# EAGLE design ESP-programmer-2 (EAGLE 9.4.2)
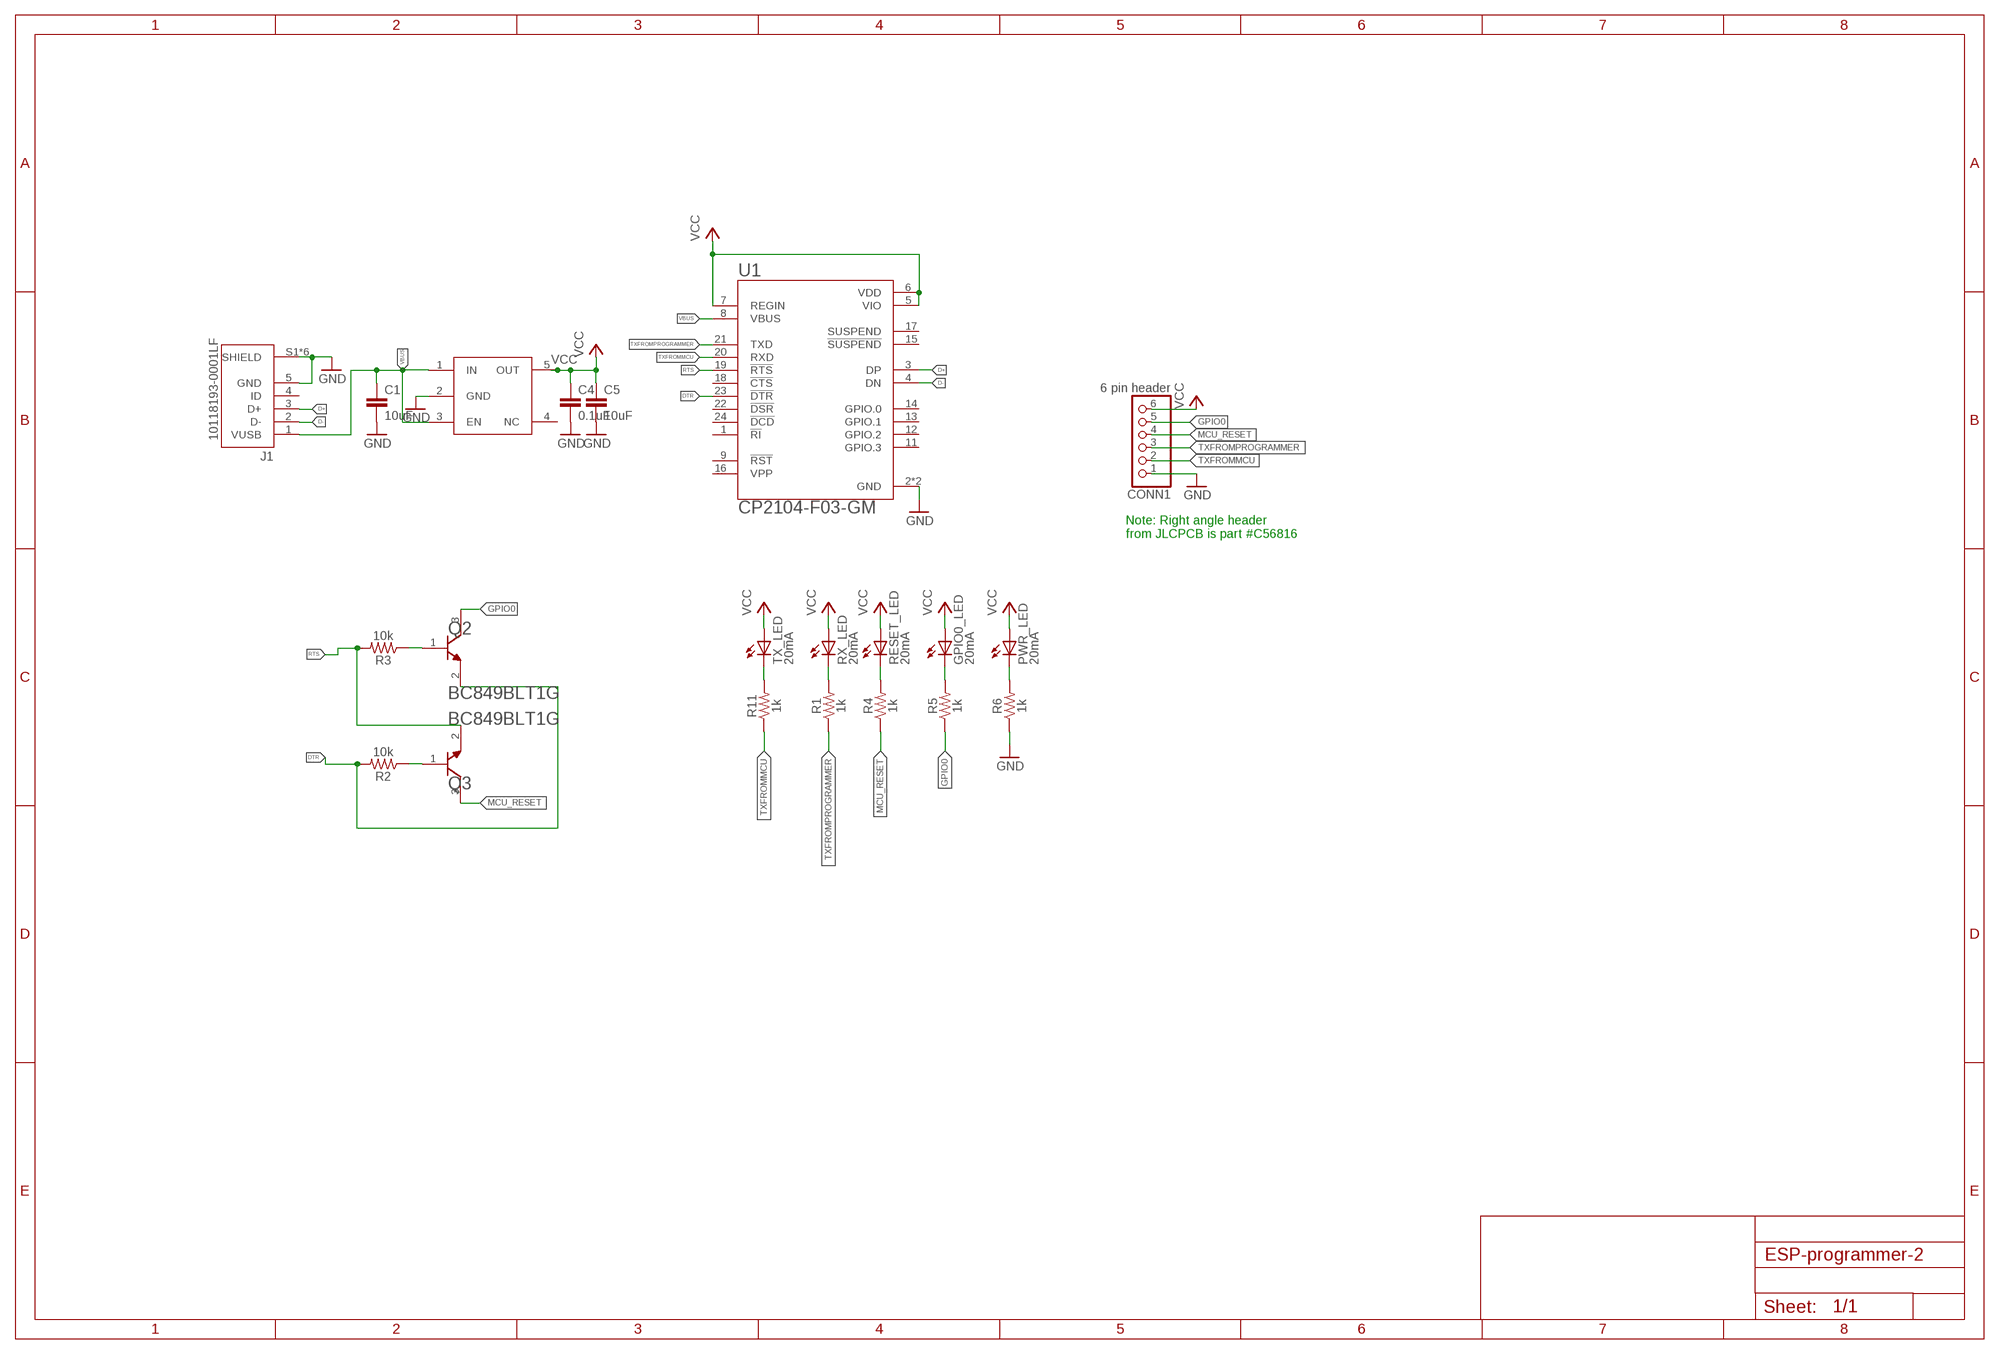
[diagram p0: schematic, sheet 1]

## Parts
C1  10uF  C-EUC0603  [C0603]
C4  0.1uF  C-EUC0603  [C0603]
C5  10uF  C-EUC0603  [C0603]
CONN1  6 pin header  PINHD-1X6  [1X06]
GPIO0_LED  20mA  LEDCHIP-LED0603  [CHIP-LED0603]
J1  10118193-0001LF  [FCI_10118193-0001LF]
PWR_LED  20mA  LEDCHIP-LED0603  [CHIP-LED0603]
Q2  ON_SEMICONDUCTOR_BC849BLT1GON_SEMICONDUCTOR_BC849BLT1G_0_0  [ON_SEMICONDUCTOR_BC849BLT1G_0]
Q3  ON_SEMICONDUCTOR_BC849BLT1GON_SEMICONDUCTOR_BC849BLT1G_0_0  [ON_SEMICONDUCTOR_BC849BLT1G_0]
R1  1k  10KOHM-0603-1/10W-1%  [0603]
R2  10k  10KOHM-0603-1/10W-1%  [0603]
R3  10k  10KOHM-0603-1/10W-1%  [0603]
R4  1k  10KOHM-0603-1/10W-1%  [0603]
R5  1k  10KOHM-0603-1/10W-1%  [0603]
R6  1k  10KOHM-0603-1/10W-1%  [0603]
R11  1k  10KOHM-0603-1/10W-1%  [0603]
REG  3v3 LDO  NCP718BSN330T1G  [NCP718BSN330T1G]
RESET_LED  20mA  LEDCHIP-LED0603  [CHIP-LED0603]
RX_LED  20mA  LEDCHIP-LED0603  [CHIP-LED0603]
TX_LED  20mA  LEDCHIP-LED0603  [CHIP-LED0603]
U1  CP2104-F03-GM  [QFN50P400X400X80-25N]

## Nets
D+: J1.3(D+) U1.3(DP)
D-: J1.2(D-) U1.4(DN)
DTR: Q2.2(E) R2.2 U1.23(!DTR)
GND: C1.2 C4.2 C5.2 CONN1.1 J1.5(GND) J1.S1(SHIELD) J1.S2(SHIELD) J1.S3(SHIELD) J1.S4(SHIELD) J1.S5(SHIELD) J1.S6(SHIELD) R6.1 REG.2(GND) U1.2(GND) U1.25(GND)
GPIO0: CONN1.5 Q2.3(C) R5.1
MCU_RESET: CONN1.4 Q3.3(C) R4.1
N$3: Q3.1(B) R2.1
N$4: Q2.1(B) R3.1
RTS: Q3.2(E) R3.2 U1.19(!RTS)
STATUSTOLED: R11.2 TX_LED.C
STATUSTOLED1: R1.2 RX_LED.C
STATUSTOLED2: R4.2 RESET_LED.C
STATUSTOLED3: GPIO0_LED.C R5.2
STATUSTOLED4: PWR_LED.C R6.2
TXFROMMCU: CONN1.2 R11.1 U1.20(RXD)
TXFROMPROGRAMMER: CONN1.3 R1.1 U1.21(TXD)
VBUS: C1.1 J1.1(VUSB) REG.1(IN) REG.3(EN) U1.8(VBUS)
VCC: C4.1 C5.1 CONN1.6 GPIO0_LED.A PWR_LED.A REG.5(OUT) RESET_LED.A RX_LED.A TX_LED.A U1.5(VIO) U1.6(VDD) U1.7(REGIN)
Unconnected: J1.4(ID) REG.4(NC) U1.1(!RI) U1.9(!RST!) U1.11(GPIO.3) U1.12(GPIO.2) U1.13(GPIO.1) U1.14(GPIO.0) U1.15(!SUSPEND!) U1.16(VPP) U1.17(SUSPEND) U1.18(!CTS) U1.22(!DSR) U1.24(!DCD)

## Notes on the sheet
- Note: Right angle header
  from JLCPCB is part #C56816

## Library data of the parts
C1 C4 C5 = rcl:C-EU: CAPACITOR, European symbol; SPICEPREFIX: C
CONN1 = adafruit:PINHD-1X6: PIN HEADER
GPIO0_LED PWR_LED RESET_LED RX_LED TX_LED = led:LED: LED OSRAM: - CHIPLED LG R971, LG N971, LY N971, LG Q971, LY Q971, LO R971, LY R971 LH N974, LH R974 LS Q976, LO Q976, LY Q976 LO Q996 - Hyper CHIPLED LW Q18S LB Q993, LB Q99A, LB R99A - SideLED LS A670, LO A670, LY A670, LG A670, LP A670 LB A673, LV A673, LT A673, LW A673 LH A674 LY A675 LS A676, LA A676, LO A676, LY A676, LW A676 LS A679, LY A679, LG A679 - Hyper Micro SIDELED® LS Y876, LA Y876, LO Y876, LY Y876 LT Y87S - SmartLED LW L88C, LW L88S LB L89C, LB L89S, LG L890 LS L89K, LO L89K, LY L89K LS L896, LA L896, LO L896, LY L896 - TOPLED LS T670, LO T670, LY T670, LG T670, LP T670 LSG T670, LSP T670, LSY T670, LOP T670, LYG T670 LG T671, LOG T671, LSG T671 LB T673, LV T673, LT T673, LW T673 LH T674 LS T676, LA T676, LO T676, LY T676, LB T676, LH T676, LSB T676, LW T676 LB T67C, LV T67C, LT T67C, LS T67K, LO T67K, LY T67K, LW E67C LS E67B, LA E67B, LO E67B, LY E67B, LB E67C, LV E67C, LT E67C LW T67C LS T679, LY T679, LG T679 LS T770, LO T770, LY T770, LG T770, LP T770 LB T773, LV T773, LT T773, LW T773 LH T774 LS E675, LA E675, LY E675, LS T675 LS T776, LA T776, LO T776, LY T776, LB T776 LHGB T686 LT T68C, LB T68C - Hyper Mini TOPLED® LB M676 - Mini TOPLED Santana® LG M470 LS M47K, LO M47K, LY M47K Source: http://www.osram.convergy.de LUXEON: - LUMILED® LXK2-PW12-R00, LXK2-PW12-S00, LXK2-PW14-U00, LXK2-PW14-V00 LXK2-PM12-R00, LXK2-PM12-S00, LXK2-PM14-U00 LXK2-PE12-Q00, LXK2-PE12-R00, LXK2-PE12-S00, LXK2-PE14-T00, LXK2-PE14-U00 LXK2-PB12-K00, LXK2-PB12-L00, LXK2-PB12-M00, LXK2-PB14-N00, LXK2-PB14-P00, LXK2-PB14-Q00 LXK2-PR12-L00, LXK2-PR12-M00, LXK2-PR14-Q00, LXK2-PR14-R00 LXK2-PD12-Q00, LXK2-PD12-R00, LXK2-PD12-S00 LXK2-PH12-R00, LXK2-PH12-S00 LXK2-PL12-P00, LXK2-PL12-Q00, LXK2-PL12-R00 Source: www.luxeon.com KINGBRIGHT: KA-3528ASYC Source: www.kingbright.com
J1 = 10118193-0001LF:10118193-0001LF: Micro USB B Type Receptacle; AVAILABILITY: Unavailable; DESCRIPTION: Single Port 5 Contact Shielded SMT MICRO USB B-Type Receptacle; MF: Amphenol FCI; MP: 10118193-0001LF; PACKAGE: None; PRICE: None
Q2 Q3 = On Semiconductor - BC849BLT1G:ON_SEMICONDUCTOR_BC849BLT1G: ONSC-NPN-B1E2C3-3; CIIVA_IDS: 19369299; COMPONENT_LINK_1_DESCRIPTION: Manufacturer URL; COMPONENT_LINK_1_URL: http://www.onsemi.com/; COMPONENT_LINK_3_DESCRIPTION: Package Specification; COMPONENT_LINK_3_URL: http://www.onsemi.cn/pub_link/Collateral/318-08.PDF; DATASHEET: http://www.onsemi.cn/pub_link/Collateral/BC846ALT1-D.PDF; DATASHEET_VERSION: Rev. 11; FOOTPRINT_VARIANT_NAME_0: Manufacturer Recommended; FT_MIN_MHZ: 100; IC_CONTINUOUS_A: 0.1; IMPORTED: yes; IMPORTED_FROM: vault; IMPORT_TS: 1521843736; MF: On Semiconductor; MOUNTING_TECHNOLOGY: Surface Mount; MPN: BC849BLT1G; PACKAGE: SOT-23-3-318-08; PACKAGE_DESCRIPTION: 3-Pin Small Outline Transistor, Body 2.92 x 1.3 mm, Pitch 0.95 mm; PACKAGE_VERSION: Rev. AP, 11/2009; PACKING: Tape and Reel; POLARITY: NPN; PREFIX: Q; RELEASE_DATE: 1406898388; ROHS: Yes; VAULT_GUID: 19D3C7D6-08FD-4A81-9BD4-62C7617130FB; VAULT_REVISION: B4675A61-FAF7-4072-9C56-0A9635A35669
R1 R4-R6 R11 = SparkFun-Resistors:10KOHM: 10kΩ resistor A resistor is a passive two-terminal electrical component that implements electrical resistance as a circuit element. Resistors act to reduce current flow, and, at the same time, act to lower voltage levels within circuits. - Wikipedia; PROD_ID: RES-00824; VALUE: 10k
R2 R3 = SparkFun-Resistors:10KOHM: 10kΩ resistor A resistor is a passive two-terminal electrical component that implements electrical resistance as a circuit element. Resistors act to reduce current flow, and, at the same time, act to lower voltage levels within circuits. - Wikipedia; PROD_ID: RES-00824
REG = IC-packages_BIG-pack V1.0:NCP718BSN330T1G
U1 = CP2104:CP2104: Silabs CP2104 USB to UART Bridge; AVAILABILITY: Unavailable; DESCRIPTION: USB to UART Bridge; MF: Silicon Labs; MP: CP2104; PACKAGE: QFN-24 Silicon Labs; PRICE: None

## Board
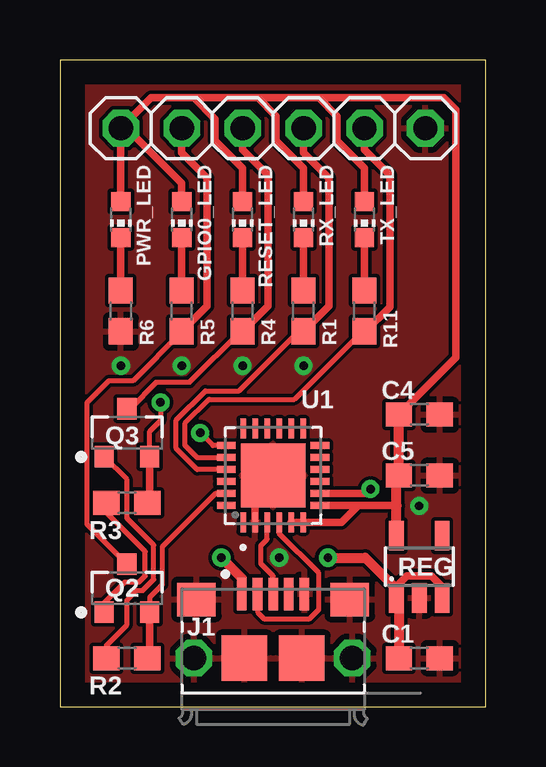
[diagram p1: board, top side]
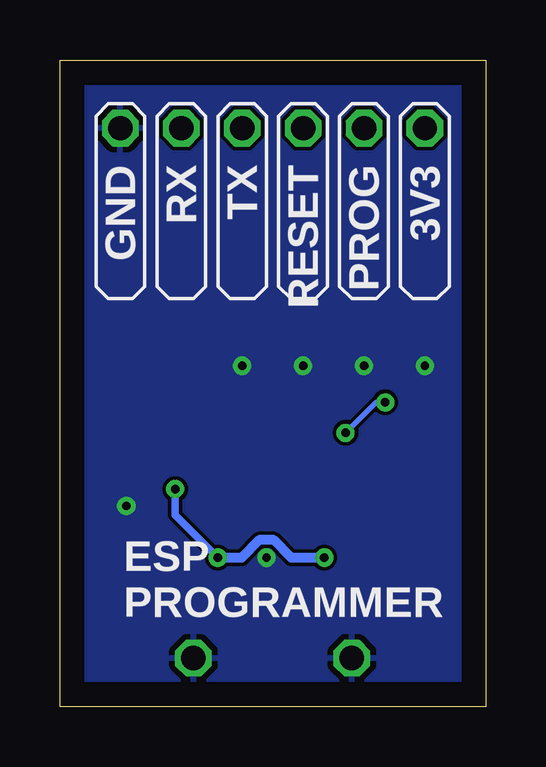
[diagram p2: board, bottom side, seen from below]

Size 17.76 x 26.98 mm. Coordinates in mm from the lower left corner, seen from the top.
Outline: 0,0 17.76,0 17.76,26.98 0,26.98 0,0
Copper layers (1*16): Top 0.035mm / dielectric 1.5mm / Bottom 0.035mm
Design rules "default": minimum track width 6mil, minimum drill 0.35mm, track to track 6mil, track to pad 6mil, pad to pad 6mil, via to via 6mil, smd to smd 6mil, copper to edge 40mil, drill to drill 6mil, minimum pad ring 10mil, minimum via ring 8mil, stop-mask expansion 4mil, vias tented up to drill 0mil, thermal gap 10mil

### Footprints (pad centres in the part's own frame; a part is rotated, then mirrored left to right if it is on the bottom)
C0603 = smd 1.1 x 1: 1 -0.85,0; 2 0.85,0
1X06 = drill 1.016 octagon: 1 -6.35,0; 2 -3.81,0; 3 -1.27,0; 4 1.27,0; 5 3.81,0; 6 6.35,0
CHIP-LED0603 = smd 0.8 x 0.8: A 0,-0.75; C 0,0.75
FCI_10118193-0001LF = smd 0.4 x 1.35: 1 -1.3,2.675; 2 -0.65,2.675; 3 0,2.675; 4 0.65,2.675; 5 1.3,2.675 | smd 1.6 x 1.4: S1 -3.2,2.45; S2 3.2,2.45 | smd 1.9 x 1.9: S3 1.2,0; S4 -1.2,0 | drill 1.016 pad 1.27 octagon: S5 -3.3,0; S6 3.3,0
ON_SEMICONDUCTOR_BC849BLT1G_0 = smd 0.9 x 0.8: 1 -1,0.95; 2 -1,-0.95; 3 1,0
0603 = smd 1.1 x 1: 1 -0.85,0; 2 0.85,0
NCP718BSN330T1G = smd 0.62 x 1.22: 1 -0.95,-1.3; 2 0,-1.3; 3 0.95,-1.3; 4 0.95,1.3; 5 -0.95,1.3
QFN50P400X400X80-25N = smd 0.81 x 0.26: 1 -1.955,1.25; 2 -1.955,0.75; 3 -1.955,0.25; 4 -1.955,-0.25; 5 -1.955,-0.75; 6 -1.955,-1.25; 13 1.955,-1.25; 14 1.955,-0.75; 15 1.955,-0.25; 16 1.955,0.25; 17 1.955,0.75; 18 1.955,1.25 | smd 0.26 x 0.81: 7 -1.25,-1.955; 8 -0.75,-1.955; 9 -0.25,-1.955; 10 0.25,-1.955; 11 0.75,-1.955; 12 1.25,-1.955; 19 1.25,1.955; 20 0.75,1.955; 21 0.25,1.955; 22 -0.25,1.955; 23 -0.75,1.955; 24 -1.25,1.955 | smd 2.68 x 2.68: 25 0,0

### Placement (x,y rotation side)
C1  14.99,2.03 0 top
C4  14.99,12.19 0 top
C5  14.99,9.65 0 top
CONN1  8.89,24.13 180 top
GPIO0_LED  5.08,20.32 180 top
J1  8.89,2.03 0 top
PWR_LED  2.54,20.32 180 top
Q2  2.79,4.95 90 top
Q3  2.79,11.43 90 top
R1  10.16,16.51 90 top
R2  2.79,2.03 0 top
R3  2.79,8.51 0 top
R4  7.62,16.51 90 top
R5  5.08,16.51 90 top
R6  2.54,16.51 90 top
R11  12.7,16.51 90 top
REG  14.99,5.84 0 top
RESET_LED  7.62,20.32 180 top
RX_LED  10.16,20.32 180 top
TX_LED  12.7,20.32 180 top
U1  8.89,9.65 90 top

### Tracks (layer width: path | path; a pad name or v marks a point on that pad's centre or on a via)
D+
  Top 0.203: J1.3 8.89,5.46 8.38,5.97 8.38,6.73 8.64,6.99 U1.3
D-
  Top 0.203: J1.2 8.24,3.95 8.51,3.68 10.41,3.68 10.79,4.06 10.79,5.59 9.14,7.24 U1.4
DTR
  Top 0.203: Q2.2 3.74,4.57 4.27,5.1 4.27,6.68 6.49,8.9 U1.23
  Top 0.305: Q2.2 3.74,2.13 R2.2
GND  (via drill 0.35)
  Top 0.305: U1.2 8.14,8.9 U1.25
  other vias: 9.14,6.22 14.99,8.38 7.62,14.22 10.16,14.22 5.08,14.22 2.54,14.22
  pour Top: -2.54,28.57 21.59,28.57 21.59,-2.54 -2.54,-2.54
  pour Bottom: -2.54,28.57 21.59,28.57 21.59,-2.54 -2.54,-2.54
GPIO0
  Top 0.203: R5.1 5.08,15.62 3.05,13.59 2.04,13.59 1.12,12.68 1.12,7.63 Q2.3
  Top 0.305: CONN1.5 5.08,23.11 6.14,22.05 6.14,16.72 R5.1
MCU_RESET
  Top 0.203: Q3.3 2.92,12.43 4.03,13.54 5.41,13.54 7.53,15.66 R4.1
  Top 0.305: CONN1.4 7.62,23.24 8.68,22.18 8.68,16.72 R4.1
N$3
  Top 0.203: R2.1 1.94,2.58 2.79,3.43 2.79,4.45 3.2,4.85 3.45,4.85 3.91,5.31 3.91,6.75 2.79,7.87 2.79,9.48 Q3.1
N$4
  Top 0.203: Q2.1 1.84,4.33 2.72,5.21 3.3,5.21 3.56,5.46 3.56,6.48 1.94,8.09 R3.1
RTS  (via drill 0.35)
  Top 0.203: U1.19 6.38,10.9 v5.85,11.43 | v4.19,12.7 4.19,11.94 3.74,11.49 Q3.2
  Top 0.305: Q3.2 3.74,8.61 R3.2
  Bottom 0.203: v4.19,12.7 4.58,12.7 v5.85,11.43
STATUSTOLED
  Top 0.305: TX_LED.C R11.2
STATUSTOLED1
  Top 0.305: RX_LED.C R1.2
STATUSTOLED2
  Top 0.305: RESET_LED.C R4.2
STATUSTOLED3
  Top 0.305: GPIO0_LED.C R5.2
STATUSTOLED4
  Top 0.305: PWR_LED.C R6.2
TXFROMMCU
  Top 0.203: 12.7,15.62 R11.1 12.61,15.66 9.78,12.83 6.22,12.83 5.21,11.81 5.21,10.92 5.73,10.4 U1.20
  Top 0.305: CONN1.2 12.7,23.24 13.76,22.18 13.76,16.68 12.7,15.62
TXFROMPROGRAMMER
  Top 0.203: U1.21 5.72,9.9 4.85,10.78 4.85,11.96 6.07,13.18 7.47,13.18 9.95,15.66 R1.1
  Top 0.305: CONN1.3 10.16,23.11 11.22,22.05 11.22,16.72 R1.1
VBUS  (via drill 0.35)
  Top 0.305: 14.14,4.44 REG.1 14.04,5.02 14.48,5.46 15.49,5.46 15.94,5.02 REG.3 | v12.95,9.09 12.77,8.9 U1.8
  Top 0.406: 14.14,4.44 C1.1 | J1.1 7.59,5.36 v6.73,6.22 | v11.18,6.22 12.74,6.22 14.04,4.92 REG.1
  Bottom 0.305: v11.18,6.22 12.95,8 v12.95,9.09
  Bottom 0.406: v6.73,6.22 8.11,6.22 8.84,6.96 9.45,6.96 10.18,6.22 v11.18,6.22
VCC
  Top 0.305: CONN1.6 PWR_LED.A | GPIO0_LED.A 5.08,21.83 2.78,24.13 CONN1.6 | CONN1.6 3.81,25.4 5.59,25.4 | 5.59,25.4 6.48,24.51 6.48,23.61 7.62,22.47 RESET_LED.A | 5.59,25.4 8.26,25.4 | 8.26,25.4 9.02,24.64 9.02,23.61 10.16,22.47 RX_LED.A | 8.26,25.4 10.79,25.4 | 10.79,25.4 11.56,24.64 11.56,23.61 12.7,22.47 TX_LED.A | U1.7 12.45,8.4 | 12.45,8.4 14.02,8.4 14.04,8.38 | 12.45,8.4 11.74,7.7 U1.6 U1.5 | 10.79,25.4 16,25.4 16.51,24.89 16.51,14.57 C4.1
  Top 0.406: REG.5 14.04,8.38 14.04,9.55 C5.1 C4.1

### Text on the board
tPlace: REG
bPlace: 3V3 | PROG | RESET | TX | RX | GND | ESP / PROGRAMMER